# Altium schematic sheet STM3205P_DACLogicGates.SchDoc
size A3; Organization: Canis Tech; Address1: -; Address2: -; Address3: -; Address4: Indaiatuba/SP; Address5: Brazil
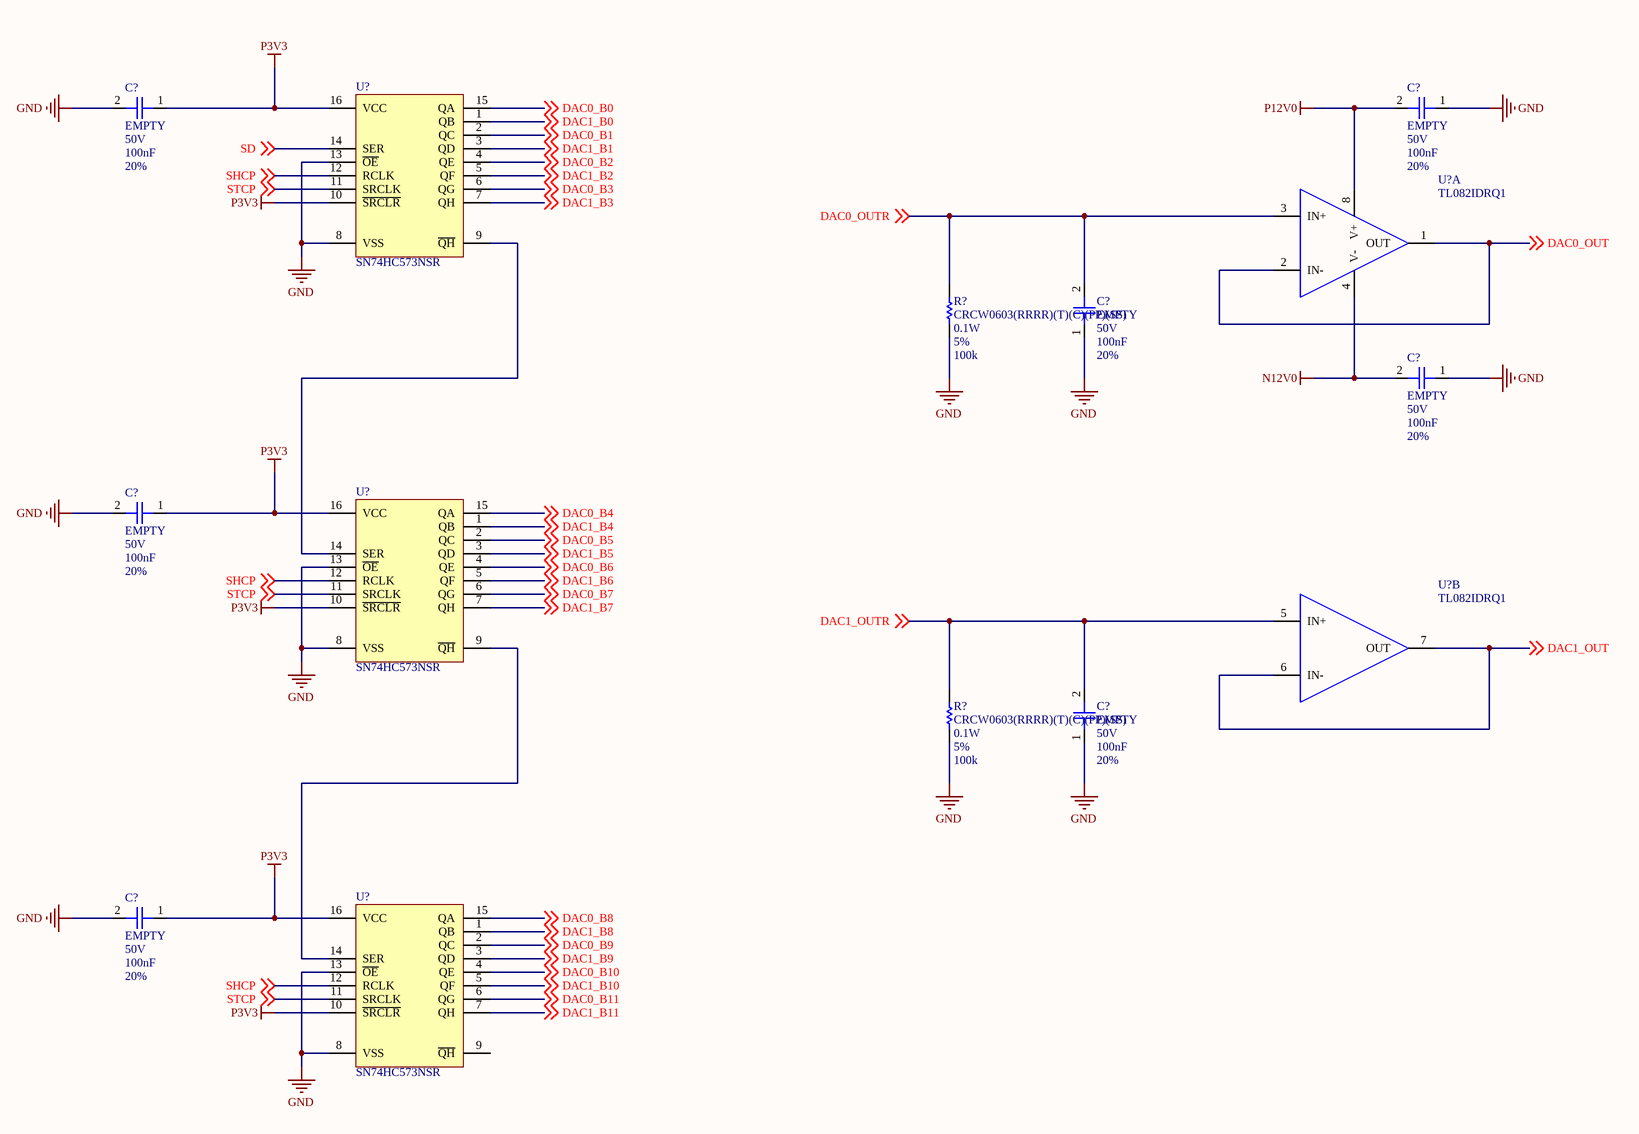
[diagram p0: STM3205P_DACLogicGates.SchDoc]

## Parts
(Parts that share a designator on the sheet are numbered #1, #2 ... from top to bottom, then left to right.)
C?#1  value 100nF  PartNumber1: EMPTY  Voltage: 50V  Tolerance: 20%  [CAP0603]  (hidden comment: CC0603)
C?#2  value 100nF  PartNumber1: EMPTY  Voltage: 50V  Tolerance: 20%  [CAP0603]  (hidden comment: CC0603)
C?#3  value 100nF  PartNumber1: EMPTY  Voltage: 50V  Tolerance: 20%  [CAP0603]  (hidden comment: CC0603)
C?#4  value 100nF  PartNumber1: EMPTY  Voltage: 50V  Tolerance: 20%  [CAP0603]  (hidden comment: CC0603)
C?#5  value 100nF  PartNumber1: EMPTY  Voltage: 50V  Tolerance: 20%  [CAP0603]  (hidden comment: CC0603)
C?#6  value 100nF  PartNumber1: EMPTY  Voltage: 50V  Tolerance: 20%  [CAP0603]  (hidden comment: CC0603)
C?#7  value 100nF  PartNumber1: EMPTY  Voltage: 50V  Tolerance: 20%  [CAP0603]  (hidden comment: CC0603)
R?#1  value 100k  PartNumber1: CRCW0603(RRRR)(T)(C)(PP)(SS)  Power: 0.1W  Tolerance: 5%  [RES0603]  (hidden comment: Chip Resistor)
R?#2  value 100k  PartNumber1: CRCW0603(RRRR)(T)(C)(PP)(SS)  Power: 0.1W  Tolerance: 5%  [RES0603]  (hidden comment: Chip Resistor)
U?#1  PartNumber1: SN74HC573NSR  [SOIC-16-3.9mm]  (hidden comment: CD74HC595M96)
U?#2  TL082IDRQ1  [SOIC-08-3.9mm]  (part A of 2)
U?#3  PartNumber1: SN74HC573NSR  [SOIC-16-3.9mm]  (hidden comment: CD74HC595M96)
U?#4  TL082IDRQ1  [SOIC-08-3.9mm]  (part B of 2)
U?#5  PartNumber1: SN74HC573NSR  [SOIC-16-3.9mm]  (hidden comment: CD74HC595M96)

## Nets
GND: C?#1.2 C?#2.1 C?#3.1 C?#4.1 C?#5.2 C?#6.1 C?#7.2 R?#1.1 R?#2.1 U?#1.8(VSS) U?#1.13(~{OE}) U?#3.8(VSS) U?#3.13(~{OE}) U?#5.8(VSS) U?#5.13(~{OE})
N12V0: C?#4.2 U?#2.4(V-)
P3V3: C?#1.1 C?#5.1 C?#7.1 U?#1.10(~{SRCLR}) U?#1.16(VCC) U?#3.10(~{SRCLR}) U?#3.16(VCC) U?#5.10(~{SRCLR}) U?#5.16(VCC)
P12V0: C?#2.2 U?#2.8(V+)
DAC0_B0: U?#1.15(QA) ; off-sheet DAC0_B0
DAC0_B1: U?#1.2(QC) ; off-sheet DAC0_B1
DAC0_B2: U?#1.4(QE) ; off-sheet DAC0_B2
DAC0_B3: U?#1.6(QG) ; off-sheet DAC0_B3
DAC0_B4: U?#3.15(QA) ; off-sheet DAC0_B4
DAC0_B5: U?#3.2(QC) ; off-sheet DAC0_B5
DAC0_B6: U?#3.4(QE) ; off-sheet DAC0_B6
DAC0_B7: U?#3.6(QG) ; off-sheet DAC0_B7
DAC0_B8: U?#5.15(QA) ; off-sheet DAC0_B8
DAC0_B9: U?#5.2(QC) ; off-sheet DAC0_B9
DAC0_B10: U?#5.4(QE) ; off-sheet DAC0_B10
DAC0_B11: U?#5.6(QG) ; off-sheet DAC0_B11
DAC0_OUT: U?#2.1(OUT) U?#2.2(IN-) ; off-sheet DAC0_OUT
DAC0_OUTR: C?#3.2 R?#1.2 U?#2.3(IN+) ; off-sheet DAC0_OUTR
DAC1_B0: U?#1.1(QB) ; off-sheet DAC1_B0
DAC1_B1: U?#1.3(QD) ; off-sheet DAC1_B1
DAC1_B2: U?#1.5(QF) ; off-sheet DAC1_B2
DAC1_B3: U?#1.7(QH) ; off-sheet DAC1_B3
DAC1_B4: U?#3.1(QB) ; off-sheet DAC1_B4
DAC1_B5: U?#3.3(QD) ; off-sheet DAC1_B5
DAC1_B6: U?#3.5(QF) ; off-sheet DAC1_B6
DAC1_B7: U?#3.7(QH) ; off-sheet DAC1_B7
DAC1_B8: U?#5.1(QB) ; off-sheet DAC1_B8
DAC1_B9: U?#5.3(QD) ; off-sheet DAC1_B9
DAC1_B10: U?#5.5(QF) ; off-sheet DAC1_B10
DAC1_B11: U?#5.7(QH) ; off-sheet DAC1_B11
DAC1_OUT: U?#4.6(IN-) U?#4.7(OUT) ; off-sheet DAC1_OUT
DAC1_OUTR: C?#6.2 R?#2.2 U?#4.5(IN+) ; off-sheet DAC1_OUTR
SD: U?#1.14(SER) ; off-sheet SD
SHCP: U?#1.12(RCLK) U?#3.12(RCLK) U?#5.12(RCLK) ; off-sheet SHCP
STCP: U?#1.11(SRCLK) U?#3.11(SRCLK) U?#5.11(SRCLK) ; off-sheet STCP
NetU?#1_9: U?#1.9(~{QH}) U?#3.14(SER)
NetU?#3_9: U?#3.9(~{QH}) U?#5.14(SER)

Not connected (* = marked no-connect by the designer): U?#5 9(~{QH})

## Notes on the sheet
- Title
- Author
- Checked By
- Variant
- Size:
- Revision:
- A3
- Date:
- Project
- Time:
- Sheet
- of
- File:

## Library data of the parts
C?#1-C?#7 = CC0603: Surface Mount Multilayer Ceramic Chip Capacitors  for Commercial Applications; Manufacturer1: Yageo; Published: 19-Jun-2016; LatestRevisionDate: 19-Jun-2016; Publisher: Lucas Moraes; PackageReference: CAP0603; PackageDescription: CAP0603;2 Leads
R?#1 R?#2 = CRCW0603: Thick Film Chip Resistors with CECC Approval,  available with Established Reliability; Manufacturer1: Vishay; LatestRevisionDate: 06-May-2016; PackageReference: 0603; Publisher: Lucas Moraes; PackageDescription: SMD 0603; 2 Leads; Published: 06-May-2016
U?#1 U?#3 U?#5 = CD74HC595M96: Counter Shift Registers 8-Bit Shift Register; Manufacturer1: Texas Instruments; Published: 17-Aug-2025; LatestRevisionDate: 17-Aug-2025; LatestRevisionNote: Created; PackageReference: SOIC-16-3.9mm; Publisher: Lucas Moraes; PackageDescription: SOIC-16-3.9mm;16 Leads
U?#2 U?#4 = TL082IDRQ1: Dual Operational Amplifiers FET Input; Manufacturer1: Texas Instruments; Published: 17-Agu-2025; LatestRevisionDate: 17-Agu-2025; LatestRevisionNote: Created; PackageReference: SOIC8; Publisher: Lucas Moraes; PackageDescription: SOIC8; 8 Leads; Datasheet: https://www.ti.com/lit/ds/symlink/tl071h.pdf?ts=1681808958431&ref_url=https%253A%252F%252Fwww.google.com%252F; PartNumber1: TL082IDRQ1